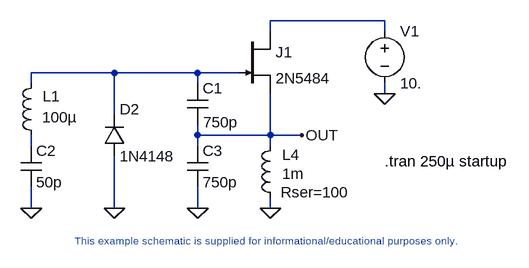
[diagram p0: schematic Clapp.asc]
Clapp.asc, the LTspice schematic file:
Version 4
SHEET 1 2772 2464
WIRE 2368 1968 2192 1968
WIRE 2192 1984 2192 1968
WIRE 2368 1984 2368 1968
WIRE 1952 2048 1824 2048
WIRE 2080 2048 1952 2048
WIRE 2144 2048 2080 2048
WIRE 1824 2064 1824 2048
WIRE 2080 2064 2080 2048
WIRE 2368 2080 2368 2064
WIRE 1952 2112 1952 2048
WIRE 2080 2144 2080 2128
WIRE 2192 2144 2192 2080
WIRE 2192 2144 2080 2144
WIRE 2240 2144 2192 2144
WIRE 1824 2160 1824 2144
WIRE 2080 2160 2080 2144
WIRE 2192 2160 2192 2144
WIRE 1824 2256 1824 2224
WIRE 1952 2256 1952 2176
WIRE 2080 2256 2080 2224
WIRE 2192 2256 2192 2240
FLAG 2368 2080 0
FLAG 2192 2256 0
FLAG 2080 2256 0
FLAG 1824 2256 0
FLAG 1952 2256 0
FLAG 2240 2144 OUT
SYMBOL NJF 2144 1984 R0
SYMATTR InstName J1
SYMATTR Value 2N5484
SYMBOL VOLTAGE 2368 1968 R0
SYMATTR InstName V1
SYMATTR Value 10.
SYMBOL ind 2208 2144 M0
WINDOW 0 -2 30 Right 2
WINDOW 3 -2 59 Right 2
WINDOW 39 0 88 Right 2
SYMATTR InstName L4
SYMATTR Value 1m
SYMATTR SpiceLine Rser=100
SYMBOL cap 2064 2064 R0
WINDOW 3 25 60 Left 2
SYMATTR Value 750p
SYMATTR InstName C1
SYMBOL cap 1808 2160 R0
SYMATTR InstName C2
SYMATTR Value 50p
SYMBOL cap 2064 2160 R0
SYMATTR InstName C3
SYMATTR Value 750p
SYMBOL ind 1840 2048 M0
WINDOW 0 -2 36 Right 2
WINDOW 3 -1 68 Right 2
SYMATTR InstName L1
SYMATTR Value 100µ
SYMBOL diode 1936 2176 M180
WINDOW 0 24 72 Left 2
WINDOW 3 24 0 Left 2
SYMATTR InstName D2
SYMATTR Value 1N4148
TEXT 2368 2184 Left 2 !.tran 250µ startup
TEXT 2176 2296 Top 1 ;This example schematic is supplied for informational/educational purposes only.

The netlist it stands for:
* Clapp.asc
J1 N001 N002 OUT 2N5484
V1 N001 0 10.
L4 OUT 0 1m Rser=100
C1 N002 OUT 750p
C2 N003 0 50p
C3 OUT 0 750p
L1 N002 N003 100µ
D2 0 N002 1N4148
.model D D
.lib standard.dio
.model NJF NJF
.model PJF PJF
.lib standard.jft
.tran 250µ startup
* This example schematic is supplied for informational/educational purposes only.
.backanno
.end